# EAGLE design 20-12-2020-10pm (EAGLE 9.6.2)
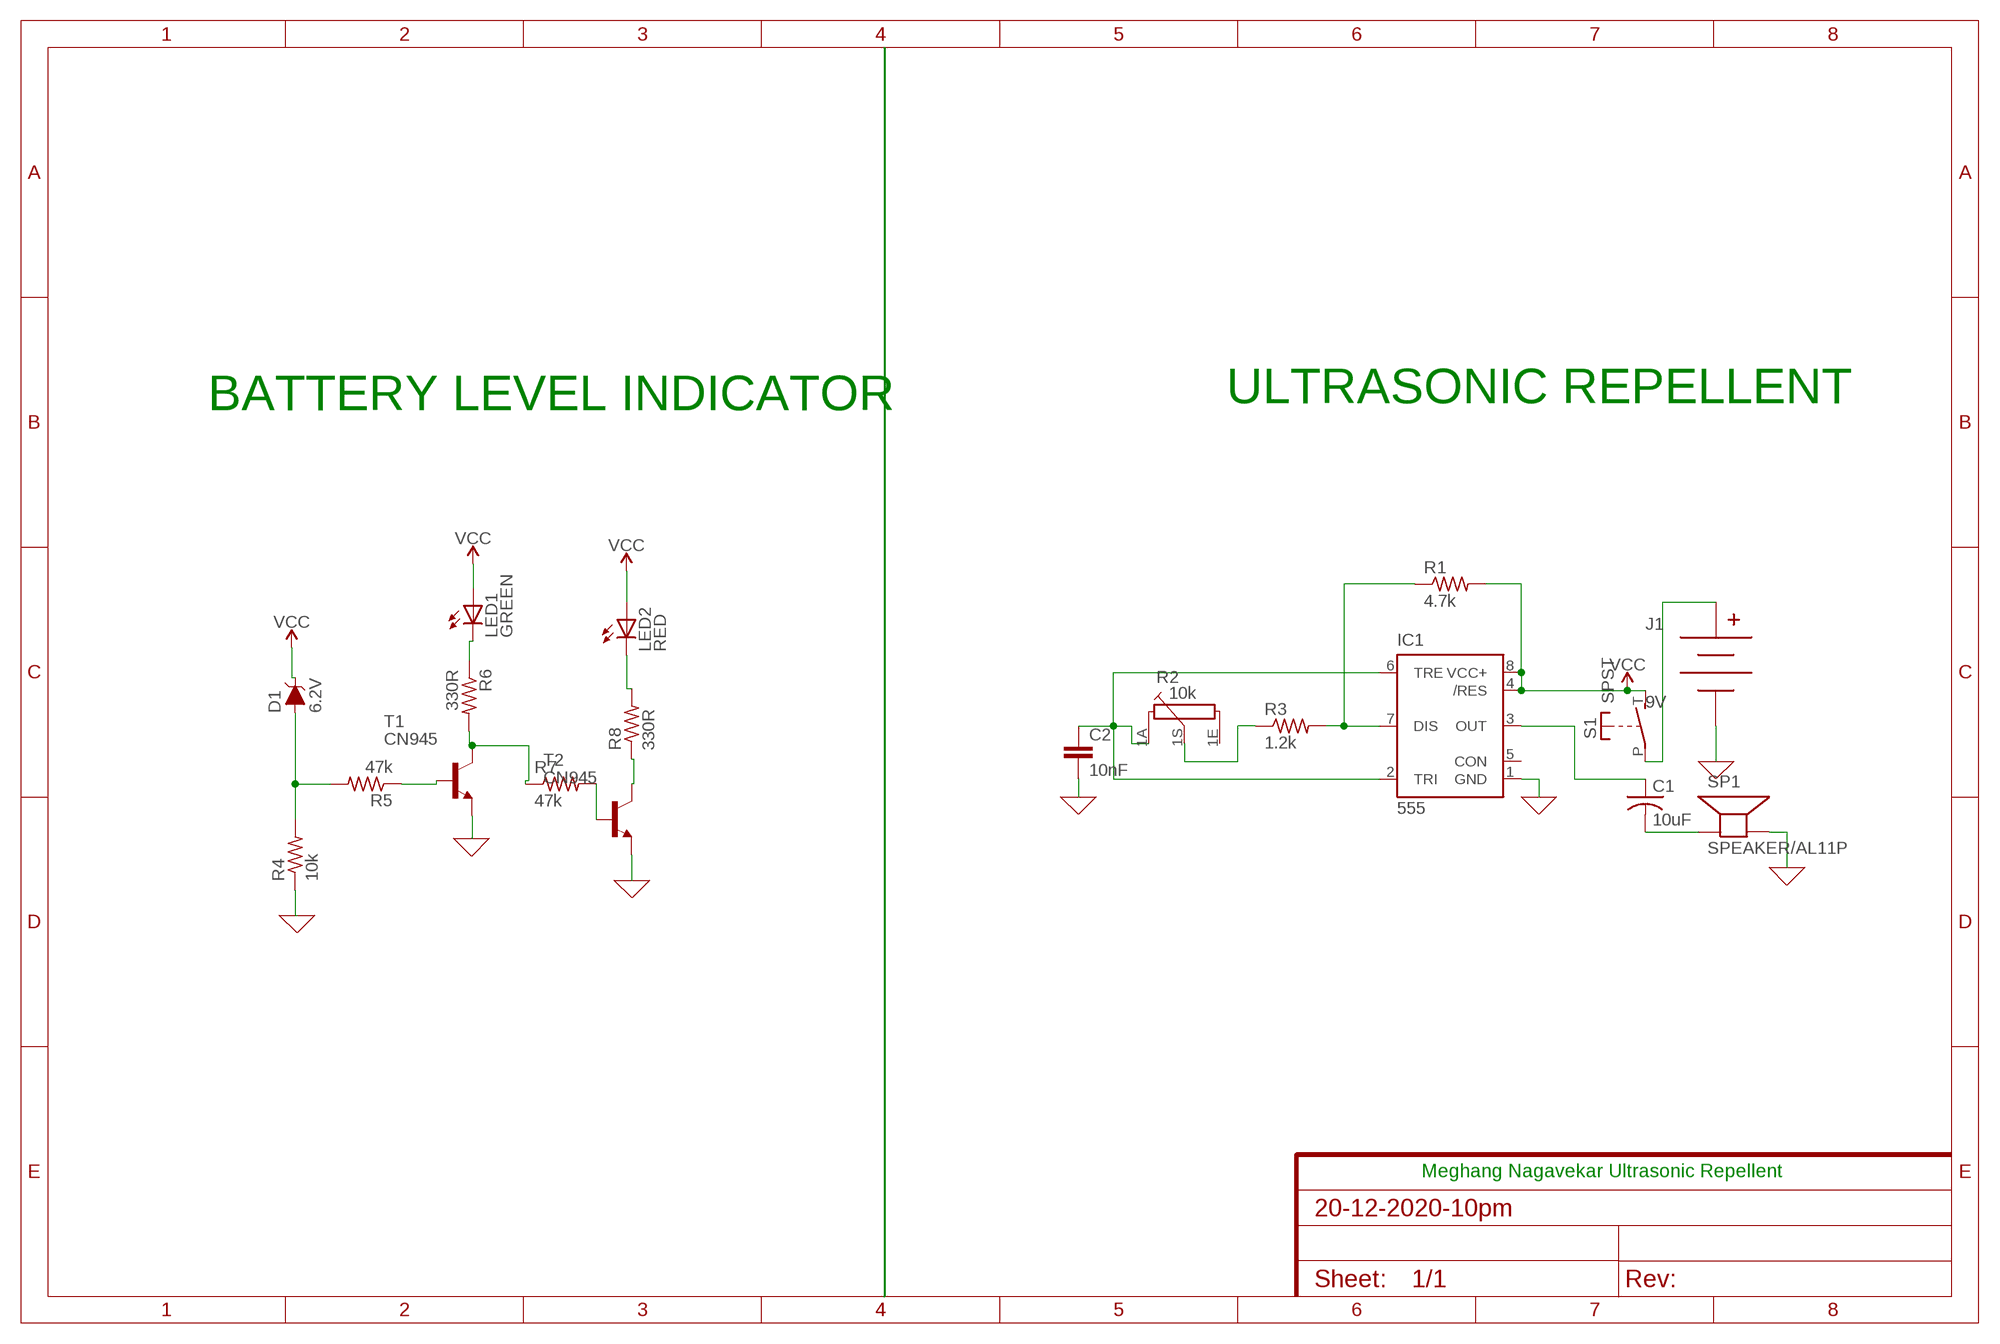
[diagram p0: schematic, sheet 1]

## Parts
C1  10uF  C-USC0805  [C0805]
C2  10nF  10NF-0603-50V-10%  [0603]
D1  6.2V  DIODE-ZENER-BZT52C3V6S  [SOD-323]
IC1  555  555D  [SO08]
J1  9V  BC9VPC  [BC9VPC]
LED1  GREEN  LED5MM  [LED5MM]
LED2  RED  LED5MM  [LED5MM]
R1  4.7k  R-US_R0805  [R0805]
R2  10k  PC16S  [PC16S]
R3  1.2k  R-US_R0805  [R0805]
R4  10k  R-US_R0805  [R0805]
R5  47k  R-US_R0805  [R0805]
R6  330R  R-US_R0805  [R0805]
R7  47k  R-US_R0805  [R0805]
R8  330R  R-US_R0805  [R0805]
S1  SPST  [JUDCOSPST]
SP1  SPEAKER/AL11P  [AL11P]
T1  CN945  2N2222  [TO92-EBC-OVAL]
T2  CN945  2N2222  [TO92-EBC-OVAL]

## Nets
0: C2.2 IC1.1(GND) J1.V- R4.1 SP1.- T1.E T2.E ; supply symbol labelled GND
N$1: J1.V+ S1.P
N$2: IC1.7(DIS) R1.1 R3.2
N$3: C1.1 IC1.3(OUT)
N$4: C1.2 SP1.+
N$5: R2.1S R3.1
N$6: C2.1 IC1.2(TRI) IC1.6(TRE) R2.1A
N$7: D1.A R4.2 R5.2
N$8: R5.1 T1.B
N$9: R6.2 R7.1 T1.C
N$10: R7.2 T2.B
N$11: R8.1 T2.C
N$12: LED1.K(C) R6.1
N$13: LED2.K(C) R8.2
VCC: D1.C IC1.4(/RES) IC1.8(VCC+) LED1.A LED2.A R1.2 S1.T(S)
Unconnected: IC1.5(CON) R2.1E

## Notes on the sheet
- BATTERY LEVEL INDICATOR | ULTRASONIC REPELLENT
- Meghang Nagavekar Ultrasonic Repellent

## Library data of the parts
C1 = adafruit:C-US: CAPACITOR, American symbol
C2 = SparkFun-Capacitors:10NF: 0.01uF/10nF/10,000pF ceramic capacitors A capacitor is a passive two-terminal electrical component used to store electrical energy temporarily in an electric field. CAP-09321; PROD_ID: CAP-00867
D1 = SparkFun-DiscreteSemi:DIODE-ZENER: Zener Diode A Zener diode allows current to flow from its anode to its cathode like a normal semiconductor diode, but it also permits current to flow in the reverse direction when its "Zener voltage" is reached. - WIkipedia; PROD_ID: DIO-08199; VALUE: 3.6V
IC1 = SparkFun-IC-Special-Function:555: General purpose bipolar Timer Datasheet <http://www.sparkfun.com/datasheets/Components/General/ne555.pdf> SparkFun Products SparkFun SparkPunk Sequencer Kit <https://www.sparkfun.com/products/12707> (KIT-12707) Storefront Component: 555 Timer <https://www.sparkfun.com/products/9273> (COM-09273) Two parts valid for production: VFP: IC-11930 (M7555 PTH) VFP: IC-09173 (555 PTH) - Preferred; PROD_ID: NA-XXXXX
J1 = SparkFun-Connectors:BC9VPC: 9V Battery Holder - PC Mount Standard and Kit footprints included SparkFun Products: SparkFun SparkPunk Sound Kit <https://www.sparkfun.com/products/11177> SparkFun SparkPunk Sequencer Kit <https://www.sparkfun.com/products/12707>; PROD_ID: BATT-10855
LED1 LED2 = adafruit:LED: LED OSRAM: - CHIPLED LG R971, LG N971, LY N971, LG Q971, LY Q971, LO R971, LY R971 LH N974, LH R974 LS Q976, LO Q976, LY Q976 LO Q996 - Hyper CHIPLED LW Q18S LB Q993, LB Q99A, LB R99A - SideLED LS A670, LO A670, LY A670, LG A670, LP A670 LB A673, LV A673, LT A673, LW A673 LH A674 LY A675 LS A676, LA A676, LO A676, LY A676, LW A676 LS A679, LY A679, LG A679 - Hyper Micro SIDELED® LS Y876, LA Y876, LO Y876, LY Y876 LT Y87S - SmartLED LW L88C, LW L88S LB L89C, LB L89S, LG L890 LS L89K, LO L89K, LY L89K LS L896, LA L896, LO L896, LY L896 - TOPLED LS T670, LO T670, LY T670, LG T670, LP T670 LSG T670, LSP T670, LSY T670, LOP T670, LYG T670 LG T671, LOG T671, LSG T671 LB T673, LV T673, LT T673, LW T673 LH T674 LS T676, LA T676, LO T676, LY T676, LB T676, LH T676, LSB T676, LW T676 LB T67C, LV T67C, LT T67C, LS T67K, LO T67K, LY T67K, LW E67C LS E67B, LA E67B, LO E67B, LY E67B, LB E67C, LV E67C, LT E67C LW T67C LS T679, LY T679, LG T679 LS T770, LO T770, LY T770, LG T770, LP T770 LB T773, LV T773, LT T773, LW T773 LH T774 LS E675, LA E675, LY E675, LS T675 LS T776, LA T776, LO T776, LY T776, LB T776 LHGB T686 LT T68C, LB T68C - Hyper Mini TOPLED® LB M676 - Mini TOPLED Santana® LG M470 LS M47K, LO M47K, LY M47K Source: http://www.osram.convergy.de/
R1 R3-R8 = adafruit:R-US_: RESISTOR, American symbol
R2 = piher:PC16S: POTENTIOMETER single carbon potentiometer, 16 mm, S3ROH; OC_FARNELL: 4452940; OC_NEWARK: unknown
S1 = adafruit:SPST: Judco 50-0015-00
SP1 = adafruit:SPEAKER: SPEAKER Source: Buerklin Added PS12 (for part # PS1240 piezo) http://www.ladyada.net/library/pcb/eaglelibrary.html
T1 T2 = adafruit:2N2222: NPN TRANSISTOR Big oval pads

## Board
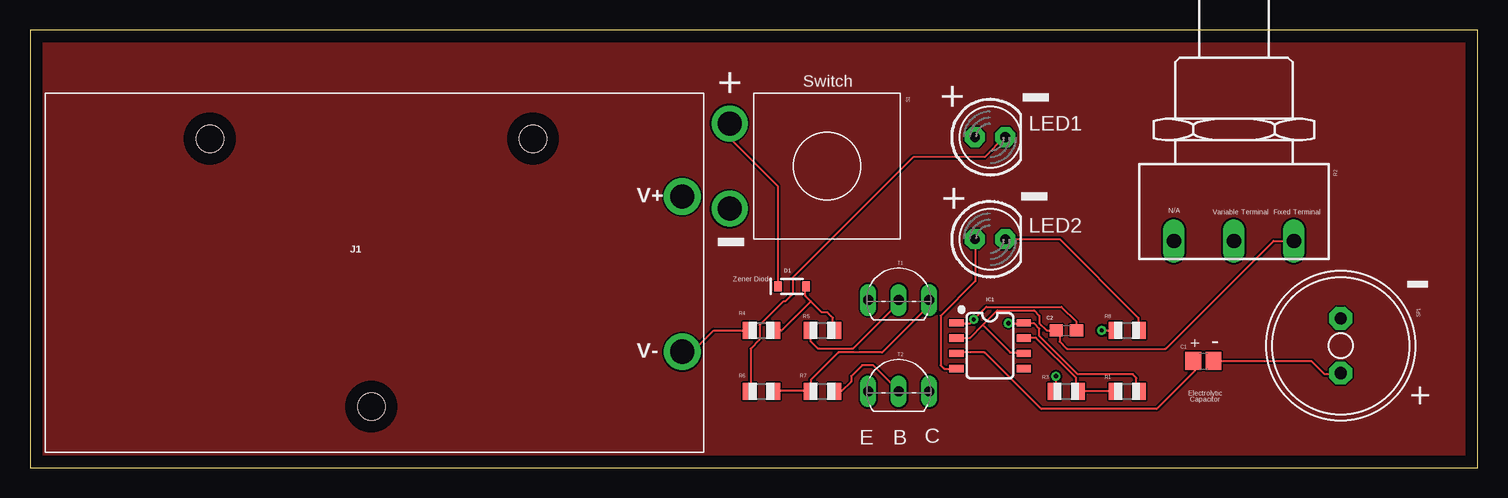
[diagram p1: board, top side]
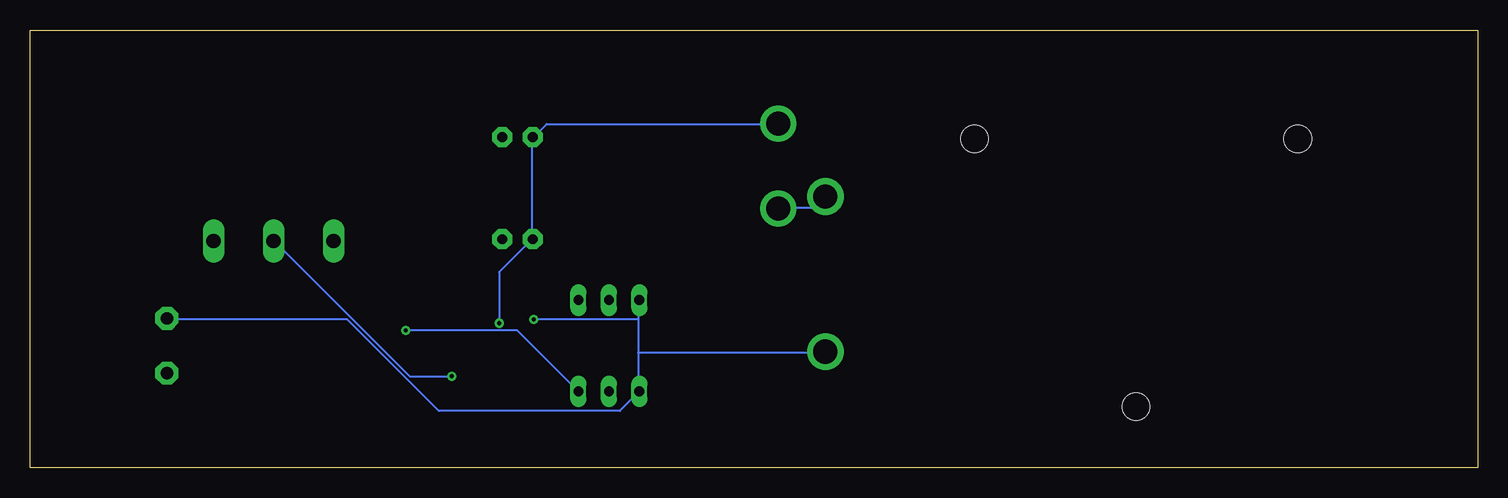
[diagram p2: board, bottom side, seen from below]

Size 120.63 x 36.5 mm. Coordinates in mm from the lower left corner, seen from the top.
Outline: 0,0 120.63,0 120.63,36.5 0,36.5 0,0
Copper layers (1*16): Top 0.035mm / dielectric 1.5mm / Bottom 0.035mm
Design rules "default": minimum track width 6mil, minimum drill 0.35mm, track to track 6mil, track to pad 6mil, pad to pad 6mil, via to via 6mil, smd to smd 6mil, copper to edge 40mil, drill to drill 6mil, minimum pad ring 10mil, minimum via ring 8mil, stop-mask expansion 4mil, vias tented up to drill 0mil, thermal gap 10mil

### Footprints (pad centres in the part's own frame; a part is rotated, then mirrored left to right if it is on the bottom)
C0805 = smd 1.3 x 1.5: 1 -0.85,0; 2 0.85,0
0603 = smd 1.1 x 1: 1 -0.85,0; 2 0.85,0
SOD-323 = smd 0.63 x 0.83: A 1.15,0; C -1.15,0
SO08 = smd 0.6 x 1.2: 1 -1.905,-2.8; 2 -0.635,-2.8; 3 0.635,-2.8; 4 1.905,-2.8; 5 1.905,2.8; 6 0.635,2.8; 7 -0.635,2.8; 8 -1.905,2.8
BC9VPC = drill 2.032: V+ 53.086,21.336; V- 53.086,8.382 | hole 2.286: 27.178,3.81; 13.716,26.162; 40.64,26.162
LED5MM = drill 0.813 pad 1.676 octagon: A -1.27,0; K 1.27,0
R0805 = smd 1.1 x 1.4: 1 -1,0; 2 1,0
PC16S = drill 1.2 long: 1A -5,6.5; 1E 5,6.5; 1S 0,6.5
JUDCOSPST = drill 2: P 3.556,-8.128; T -3.556,-8.128
AL11P = drill 1.016 pad 1.905 octagon: + 2.286,0; - -2.286,0
TO92-EBC-OVAL = drill 0.813 long: B 0,-1.27; C 2.54,-1.27; E -2.54,-1.27

### Placement (x,y rotation side)
C1  97.79,8.89 0 top
C2  86.36,11.43 0 top
D1  63.5,15.11 0 top
IC1  80.01,10.16 270 top
J1  1.27,1.27 0 top
LED1  80.01,27.56 0 top
LED2  80.01,19.05 0 top
R1  91.44,6.35 0 top
R2  100.33,25.4 180 top
R3  86.36,6.35 0 top
R4  60.96,11.43 0 top
R5  66.04,11.43 0 top
R6  60.96,6.35 0 top
R7  66.04,6.35 0 top
R8  91.44,11.43 0 top
S1  66.42,25.15 270 top
SP1  109.22,10.16 270 top
T1  72.39,15.24 0 top
T2  72.39,7.62 0 top

### Tracks (layer width: path | path; a pad name or v marks a point on that pad's centre or on a via)
0  (via drill 0.35)
  Top 0.152: R4.1 57,11.43 55.32,9.75 54.41,9.75 J1.V- | C2.2 87.17,11.43 87.17,12.19 85.95,13.41 79.7,13.41 v78.64,12.34 78.33,12.04 77.27,12.04 IC1.1
  Bottom 0.152: 69.95,12.34 69.95,13.87 T1.E | 69.95,12.34 69.95,9.6 | 69.95,9.6 69.95,6.4 T2.E 71.48,4.72 86.56,4.72 94.18,12.34 109.12,12.34 SP1.- | 69.95,12.34 v78.64,12.34 | 69.95,9.6 54.41,9.6 J1.V-
GND
  pour Top: 0,36.83 0,0 120.65,0 120.65,36.83
N$1
  Bottom 0.152: J1.V+ 55.32,21.64 58.22,21.64 S1.P
N$2
  Top 0.152: IC1.7 82.91,10.82 83.82,10.82 87.17,7.47 87.17,6.55 87.33,6.4 R3.2 87.48,6.4 90.37,6.4 R1.1
N$3
  Top 0.152: IC1.3 77.27,9.6 79.55,9.6 84.28,4.88 93.88,4.88 97.08,8.08 97.08,8.84 C1.1
N$4
  Top 0.152: C1.2 98.75,8.84 106.83,8.84 107.9,7.77 109.12,7.77 SP1.+
N$5  (via drill 0.35)
  Top 0.152: v85.5,7.62 85.5,6.4 R3.1
  Bottom 0.152: v85.5,7.62 89,7.62 100.28,18.9 R2.1S
N$6
  Top 0.152: 79.4,11.89 78.33,10.82 77.27,10.82 IC1.2 | 79.4,11.89 80.62,13.11 83.67,13.11 84.12,12.65 84.12,12.04 84.73,11.43 C2.1 85.65,11.43 85.8,11.28 85.8,10.52 86.41,9.91 94.64,9.91 103.63,18.9 105.31,18.9 R2.1A | 79.4,11.89 81.69,9.6 82.75,9.6 IC1.6
N$7
  Top 0.152: 65.08,13.87 65.99,12.95 66.45,12.95 66.9,12.5 66.9,11.43 R5.2 | 65.08,13.87 64.62,14.33 64.62,15.09 D1.A | R4.2 62.64,11.43 65.08,13.87
N$8
  Top 0.152: T1.B 72.39,13.72 68.58,9.91 65.68,9.91 65.08,10.52 65.08,11.43 R5.1
N$9
  Top 0.152: R6.2 62.03,6.4 64.92,6.4 R7.1 65.08,6.4 65.08,7.32 67.36,9.6 71.02,9.6 74.83,13.41 74.83,13.87 T1.C
N$10
  Top 0.152: R7.2 67.06,6.4 67.67,6.4 68.43,7.16 68.43,7.62 69.34,8.53 70.26,8.53 72.39,6.4 T2.B
N$11  (via drill 0.35)
  Top 0.152: v89.31,11.43 R8.1
  Bottom 0.152: v89.31,11.43 80.01,11.43 T2.C
N$12
  Top 0.152: R6.1 60.05,6.4 60.05,9.91 60.81,10.67 60.81,11.89 62.79,13.87 62.94,13.87 63.55,14.48 63.55,15.85 73.61,25.91 79.55,25.91 81.23,27.58 LED1.K
N$13
  Top 0.152: LED2.K 85.8,19.05 92.35,12.5 92.35,11.43 R8.2
VCC  (via drill 0.35)
  Top 0.152: D1.C 62.33,15.24 62.33,23.47 58.37,27.43 58.37,28.65 S1.T | R1.2 92.35,6.4 92.2,6.55 92.2,7.47 91.9,7.77 87.33,7.77 84.12,10.97 84.12,11.58 83.67,12.04 82.91,12.04 IC1.8 82.75,12.04 v81.53,12.04 | IC1.4 77.11,8.23 76.2,8.23 75.89,8.53 75.89,12.65 78.79,15.54 78.79,19.05 LED2.A
  Bottom 0.152: 78.79,19.05 78.79,27.43 LED1.A 78.64,27.58 77.57,28.65 58.37,28.65 S1.T | v81.53,12.04 81.53,16.31 78.79,19.05 | 78.79,19.05 LED2.A

### Text on the board
tNames: Switch | + | + | - | + | N/A | Variable Terminal | Fixed Terminal | - | - | Zener Diode | - | + | - | Electrolytic | Capacitor | + | E | B | C